# Altium schematic sheet Block Diagram.SchDoc
size A4; SheetNumber: 1; SheetTotal: 3
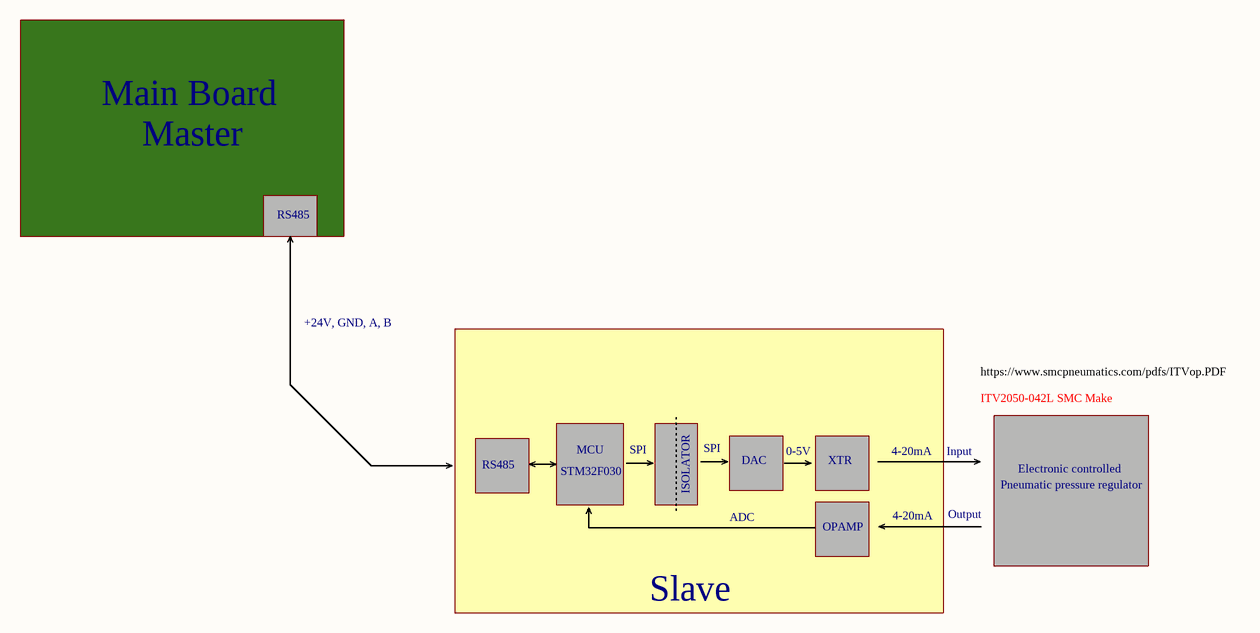
[diagram p0: Block Diagram.SchDoc]

## Notes on the sheet
- Main Board
- Master
- RS485
- +24V, GND, A, B
- https://www.smcpneumatics.com/pdfs/ITVop.PDF
- ITV2050-042L SMC Make
- STM32F030
- MCU
- SPI
- ISOLATOR
- DAC
- 0-5V
- XTR
- 4-20mA
- Input
- Pneumatic pressure regulator
- Electronic controlled
- ADC
- OPAMP
- Output
- Slave